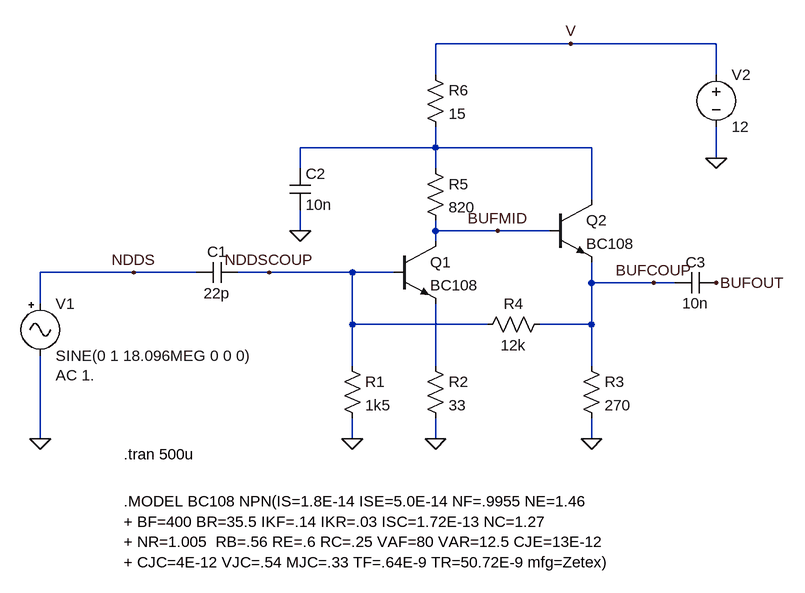
[diagram p0: schematic dds-g3wce.asc]
dds-g3wce.asc, the LTspice schematic file:
Version 4
SHEET 1 1684 696
WIRE 416 -96 208 -96
WIRE 640 -96 416 -96
WIRE 208 -48 208 -96
WIRE 640 -48 640 -96
WIRE 208 64 208 32
WIRE 208 64 0 64
WIRE 448 64 208 64
WIRE 640 80 640 32
WIRE 0 96 0 64
WIRE 208 96 208 64
WIRE 448 144 448 64
WIRE 0 192 0 160
WIRE 208 192 208 176
WIRE 304 192 208 192
WIRE 384 192 304 192
WIRE 208 208 208 192
WIRE -256 256 -400 256
WIRE -160 256 -256 256
WIRE -48 256 -96 256
WIRE 80 256 -48 256
WIRE 144 256 80 256
WIRE 448 272 448 240
WIRE 544 272 448 272
WIRE 576 272 544 272
WIRE -400 304 -400 256
WIRE 80 336 80 256
WIRE 288 336 80 336
WIRE 448 336 448 272
WIRE 448 336 368 336
WIRE 80 400 80 336
WIRE 208 400 208 304
WIRE 448 400 448 336
WIRE -400 512 -400 384
WIRE 80 512 80 480
WIRE 208 512 208 480
WIRE 448 512 448 480
FLAG -400 512 0
FLAG 80 512 0
FLAG 208 512 0
FLAG 448 512 0
FLAG 0 192 0
FLAG 640 80 0
FLAG 416 -96 V
FLAG -256 256 NDDS
FLAG -48 256 NDDSCOUP
FLAG 304 192 BUFMID
FLAG 640 272 BUFOUT
FLAG 544 272 BUFCOUP
SYMBOL cap -96 240 R90
WINDOW 0 0 32 VBottom 2
WINDOW 3 32 32 VTop 2
SYMATTR InstName C1
SYMATTR Value 22p
SYMBOL cap -16 96 R0
SYMATTR InstName C2
SYMATTR Value 10n
SYMBOL cap 640 256 R90
WINDOW 0 0 32 VBottom 2
WINDOW 3 32 32 VTop 2
SYMATTR InstName C3
SYMATTR Value 10n
SYMBOL res 64 384 R0
SYMATTR InstName R1
SYMATTR Value 1k5
SYMBOL res 192 384 R0
SYMATTR InstName R2
SYMATTR Value 33
SYMBOL res 432 384 R0
SYMATTR InstName R3
SYMATTR Value 270
SYMBOL res 384 320 R90
WINDOW 0 0 56 VBottom 2
WINDOW 3 32 56 VTop 2
SYMATTR InstName R4
SYMATTR Value 12k
SYMBOL res 192 80 R0
SYMATTR InstName R5
SYMATTR Value 820
SYMBOL res 192 -64 R0
SYMATTR InstName R6
SYMATTR Value 15
SYMBOL Misc/signal -400 288 R0
WINDOW 123 24 126 Left 2
SYMATTR Value2 AC 1.
SYMATTR InstName V1
SYMATTR Value SINE(0 1 18.096MEG 0 0 0)
SYMBOL npn 144 208 R0
SYMATTR InstName Q1
SYMATTR Value BC108
SYMBOL npn 384 144 R0
SYMATTR InstName Q2
SYMATTR Value BC108
SYMBOL voltage 640 -64 R0
SYMATTR InstName V2
SYMATTR Value 12
TEXT -272 536 Left 2 !.tran 500u
TEXT -272 608 Left 2 !.MODEL BC108 NPN(IS=1.8E-14 ISE=5.0E-14 NF=.9955 NE=1.46\n+ BF=400 BR=35.5 IKF=.14 IKR=.03 ISC=1.72E-13 NC=1.27\n+ NR=1.005  RB=.56 RE=.6 RC=.25 VAF=80 VAR=12.5 CJE=13E-12\n+ CJC=4E-12 VJC=.54 MJC=.33 TF=.64E-9 TR=50.72E-9 mfg=Zetex)

The netlist it stands for:
* dds-g3wce.asc
C1 NDDSCOUP NDDS 22p
C2 N001 0 10n
C3 BUFOUT BUFCOUP 10n
R1 NDDSCOUP 0 1k5
R2 N002 0 33
R3 BUFCOUP 0 270
R4 BUFCOUP NDDSCOUP 12k
R5 N001 BUFMID 820
R6 V N001 15
V1 NDDS 0 SINE(0 1 18.096MEG 0 0 0) AC 1.
Q1 BUFMID NDDSCOUP N002 0 BC108
Q2 N001 BUFMID BUFCOUP 0 BC108
V2 V 0 12
.model NPN NPN
.model PNP PNP
.lib standard.bjt
.tran 500u
.MODEL BC108 NPN(IS=1.8E-14 ISE=5.0E-14 NF=.9955 NE=1.46
+ BF=400 BR=35.5 IKF=.14 IKR=.03 ISC=1.72E-13 NC=1.27
+ NR=1.005  RB=.56 RE=.6 RC=.25 VAF=80 VAR=12.5 CJE=13E-12
+ CJC=4E-12 VJC=.54 MJC=.33 TF=.64E-9 TR=50.72E-9 mfg=Zetex)
.backanno
.end